# Altium schematic sheet Block_Diagram.SchDoc
size A3; SheetNumber: 1; SheetTotal: 4
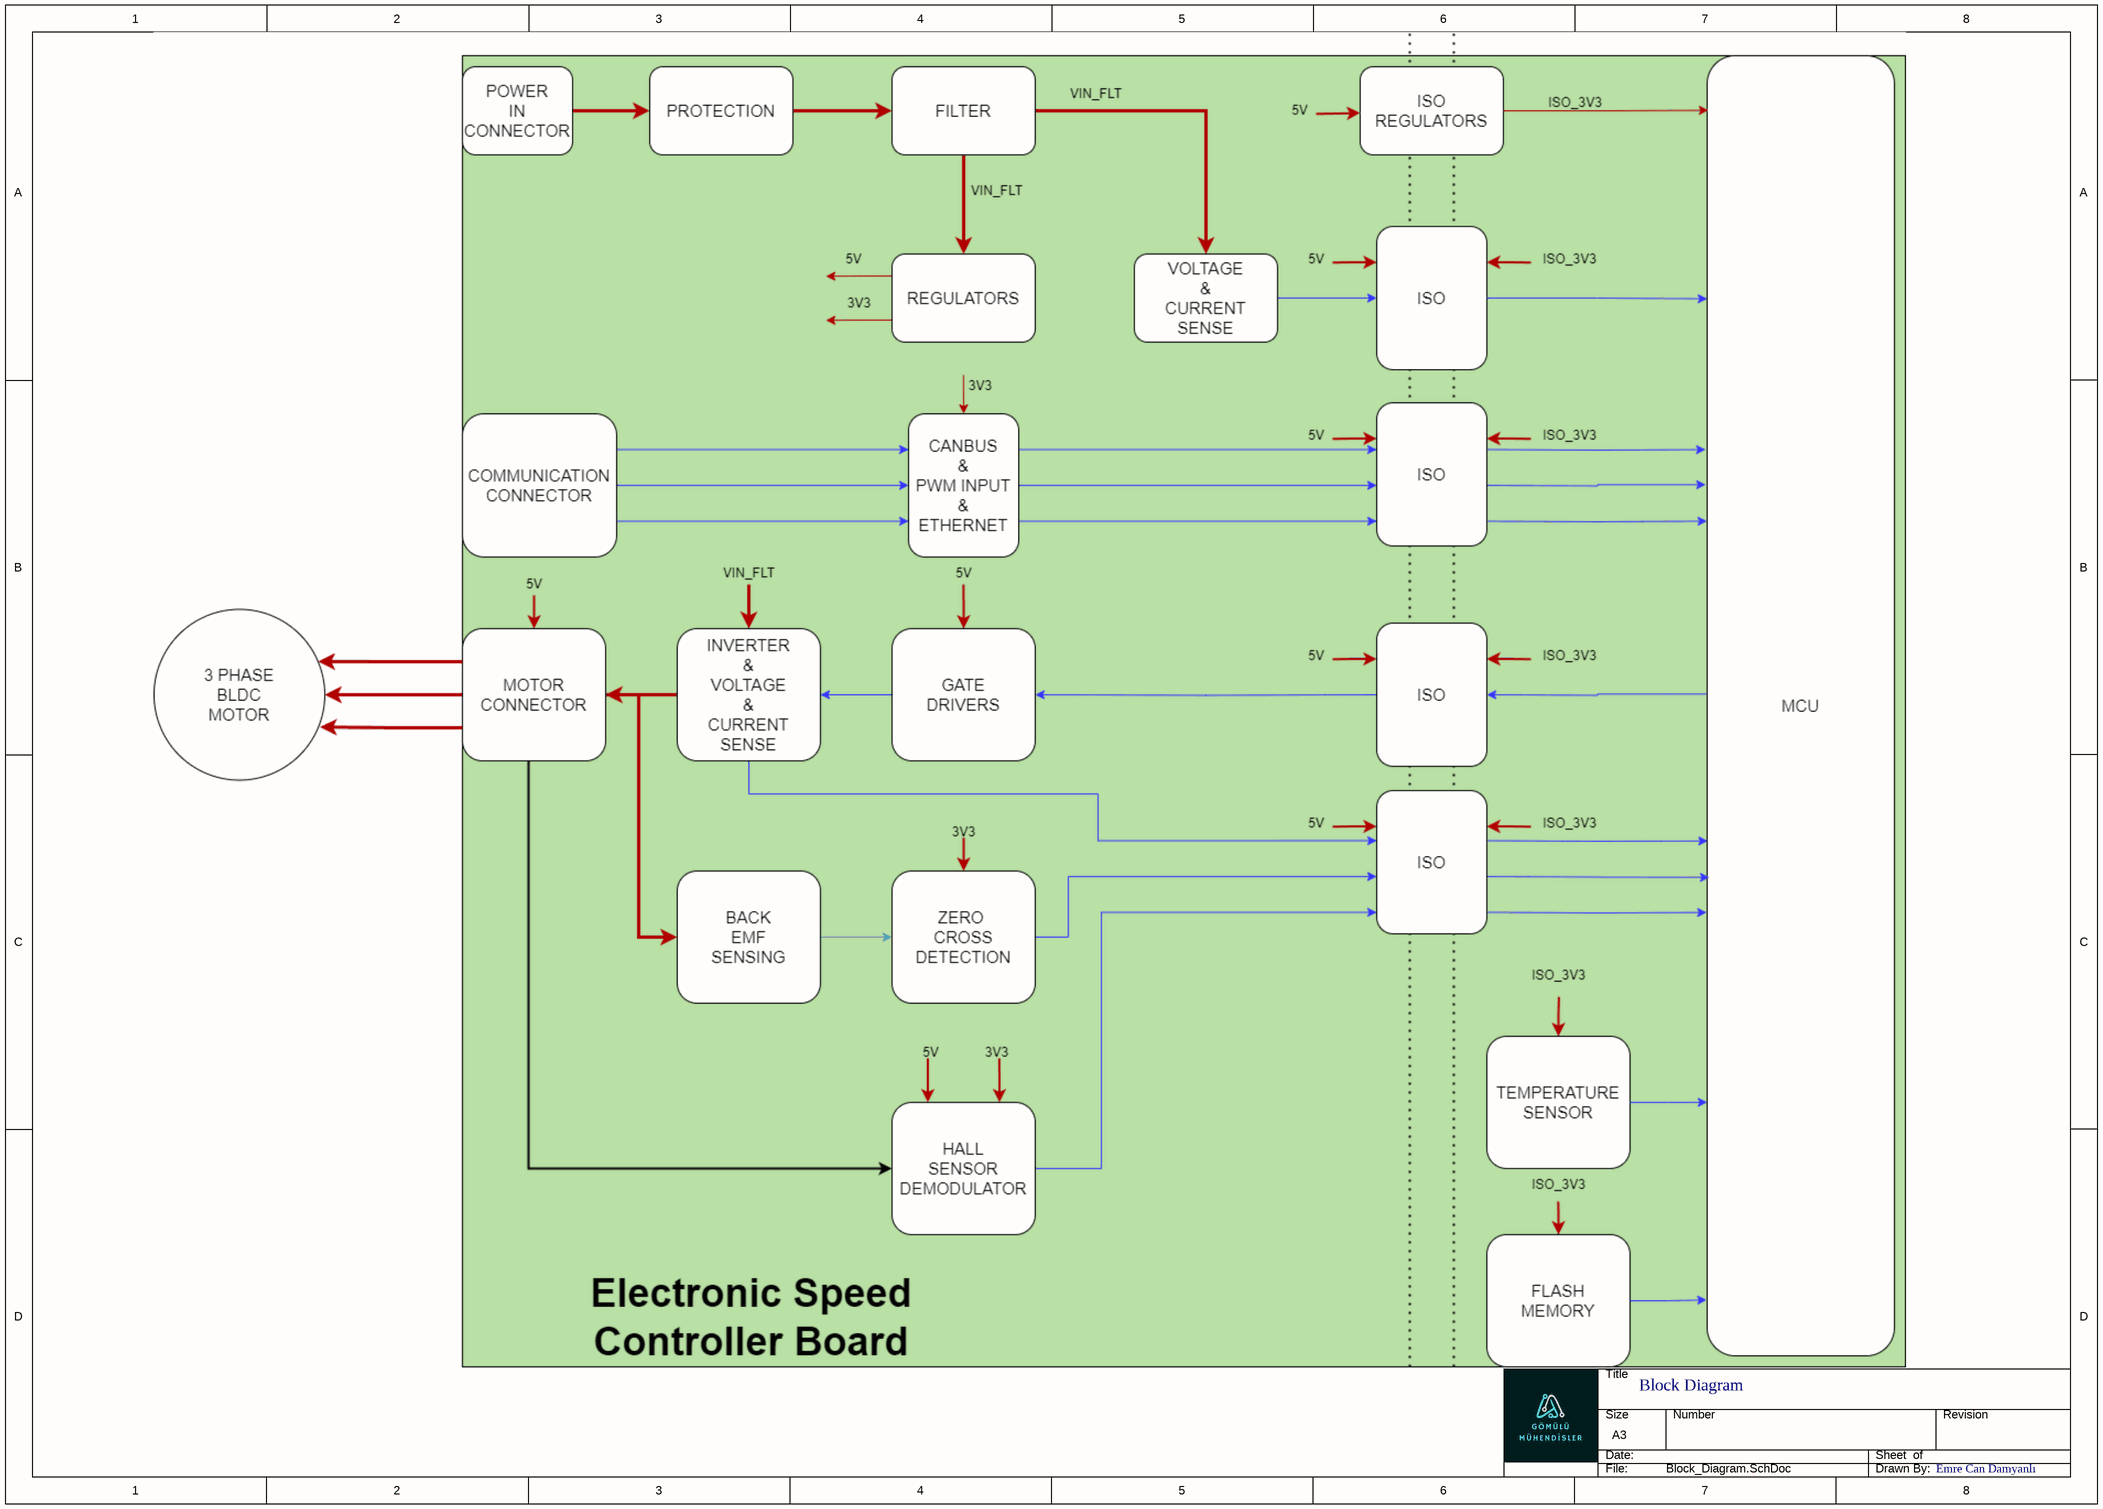
[diagram p0: Block_Diagram.SchDoc]

## Notes on the sheet
- Block Diagram
- Emre Can Damyanlı